# EAGLE design jlink_to_mini (EAGLE 9.6.2)
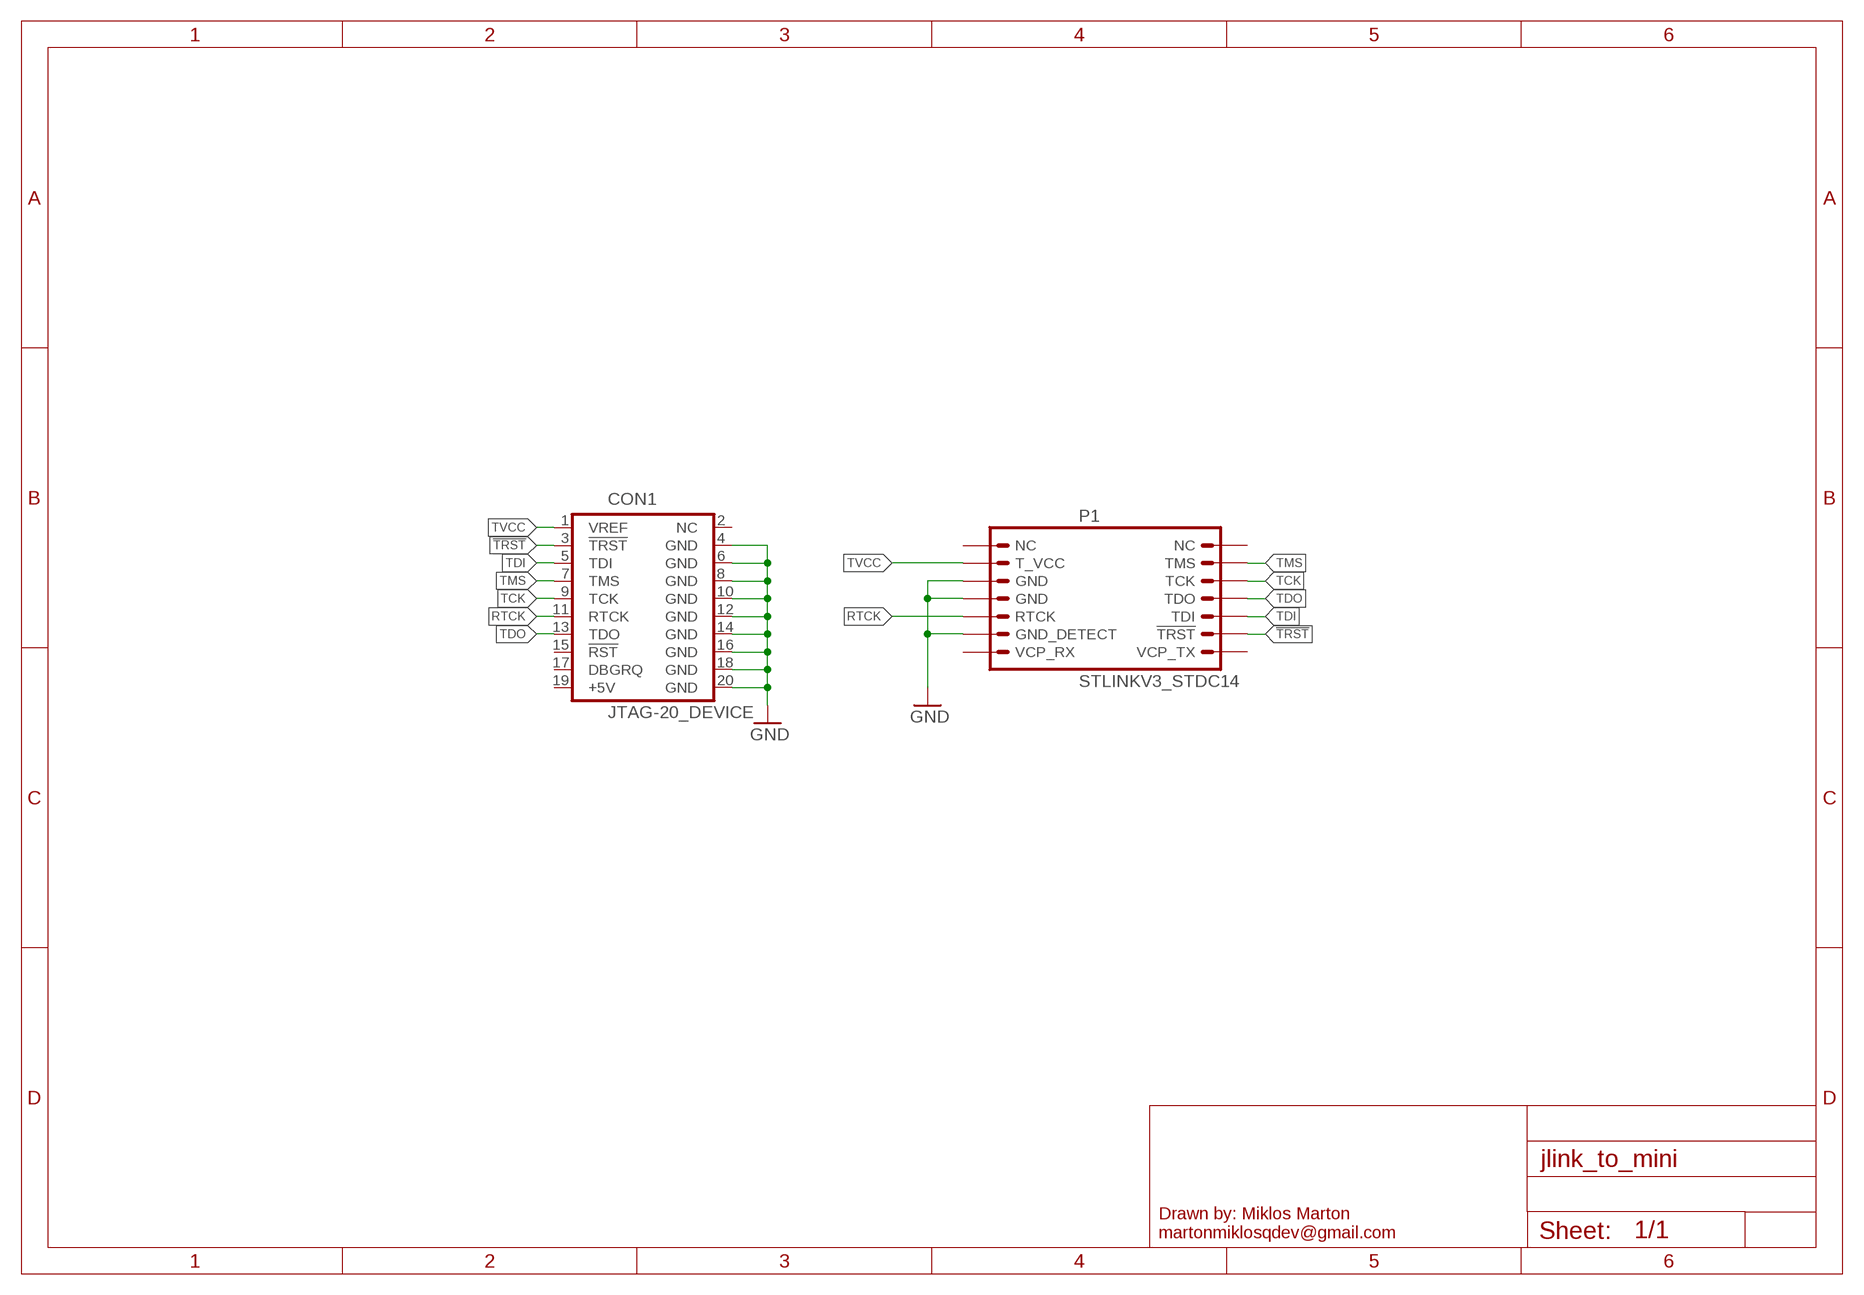
[diagram p0: schematic, sheet 1]

## Parts
CON1  JTAG-20_DEVICE  [2X10/90]
P1  STLINKV3_STDC14  [FTSH-107-01-L-DV-K]

## Nets
!TRST: CON1.3(!TRST) P1.12(!TRST)
GND: CON1.4(GND) CON1.6(GND) CON1.8(GND) CON1.10(GND) CON1.12(GND) CON1.14(GND) CON1.16(GND) CON1.18(GND) CON1.20(GND) P1.5(GND) P1.7(GND) P1.11(GND_DETECT)
RTCK: CON1.11(RTCK) P1.9(RTCK)
TCK: CON1.9(TCK) P1.6(TCK)
TDI: CON1.5(TDI) P1.10(TDI)
TDO: CON1.13(TDO) P1.8(TDO)
TMS: CON1.7(TMS) P1.4(TMS)
TVCC: CON1.1(VREF) P1.3(T_VCC)
Unconnected: CON1.2(NC) CON1.15(!RST) CON1.17(DBGRQ) CON1.19(+5V) P1.1(NC) P1.2(NC) P1.13(VCP_RX) P1.14(VCP_TX)

## Library data of the parts
CON1 = jtag:JTAG-20_DEVICE
P1 = jtag:STLINKV3_STDC14: FTSH Pin Header; OC_TME: ZL322-2X7P

## Board
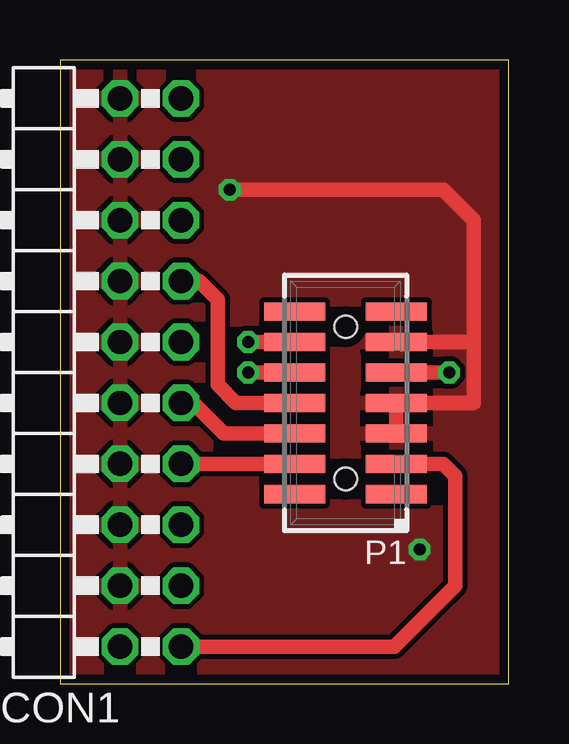
[diagram p1: board, top side]
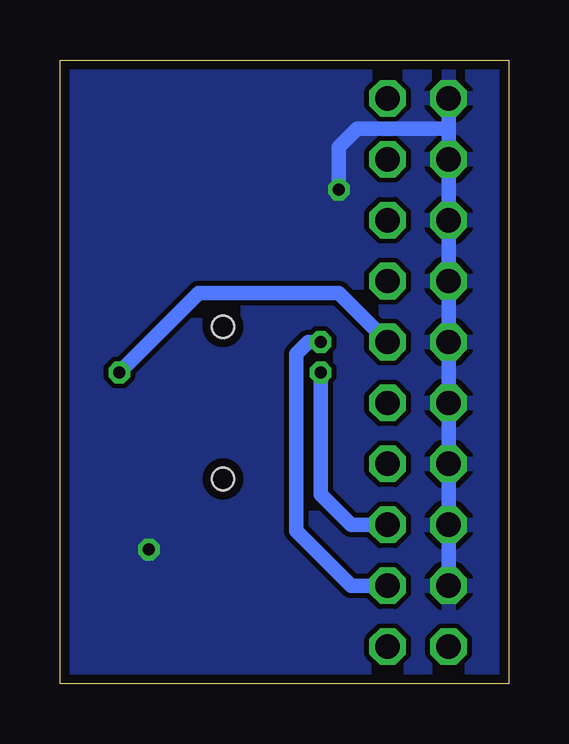
[diagram p2: board, bottom side, seen from below]

Size 18.69 x 26 mm. Coordinates in mm from the lower left corner, seen from the top.
Outline: 0,0 18.69,0 18.69,26 0,26 0,0
Copper layers (1*16): Top 0.035mm / dielectric 1.5mm / Bottom 0.035mm
Design rules "mikropan": minimum track width 8mil, minimum drill 0.5mm, track to track 8mil, track to pad 8mil, pad to pad 8mil, via to via 8mil, smd to smd 8mil, copper to edge 15mil, drill to drill 0.2mm, minimum pad ring 0.2mm, minimum via ring 0.2mm, stop-mask expansion 4mil, vias tented up to drill 0mil, thermal gap 10mil

### Footprints (pad centres in the part's own frame; a part is rotated, then mirrored left to right if it is on the bottom)
2X10/90 = drill 1.016 octagon: 1 -11.43,-6.35; 2 -11.43,-3.81; 3 -8.89,-6.35; 4 -8.89,-3.81; 5 -6.35,-6.35; 6 -6.35,-3.81; 7 -3.81,-6.35; 8 -3.81,-3.81; 9 -1.27,-6.35; 10 -1.27,-3.81; 11 1.27,-6.35; 12 1.27,-3.81; 13 3.81,-6.35; 14 3.81,-3.81; 15 6.35,-6.35; 16 6.35,-3.81; 17 8.89,-6.35; 18 8.89,-3.81; 19 11.43,-6.35; 20 11.43,-3.81
FTSH-107-01-L-DV-K = smd 0.762 x 2.54: 1 -3.81,-2.121; 2 -3.81,2.121; 3 -2.54,-2.121; 4 -2.54,2.121; 5 -1.27,-2.121; 6 -1.27,2.121; 7 0,-2.121; 8 0,2.121; 9 1.27,-2.121; 10 1.27,2.121; 11 2.54,-2.121; 12 2.54,2.121; 13 3.81,-2.121; 14 3.81,2.121 | hole 0.94: -3.175,0; 3.175,0

### Placement (x,y rotation side)
CON1  -1.31,12.97 90 top
P1  11.9,11.7 90 top

### Tracks (layer width: path | path; a pad name or v marks a point on that pad's centre or on a via)
!TRST  (via drill 0.5)
  Top 0.61: P1.12 v7.83,14.24
  Bottom 0.61: v7.83,14.24 8.34,14.24 8.85,13.73 8.85,12.97 8.85,6.37 6.56,4.08 CON1.3
GND  (via drill 0.5)
  Top 0.61: P1.5 P1.7 17.23,11.7 17.23,14.24 | 17.23,14.24 P1.11 | 17.23,14.24 17.23,19.32 15.96,20.59 v7.07,20.59
  Bottom 0.61: CON1.20 2.5,23.13 | 2.5,23.13 2.5,22.62 | 2.5,22.62 2.5,19.07 | 2.5,19.07 2.5,17.03 | 2.5,17.03 CON1.12 | CON1.12 CON1.4 | v7.07,20.59 7.07,22.37 6.31,23.13 2.5,23.13 | 2.5,22.62 CON1.18 2.5,19.07 | 2.5,17.03 CON1.16 CON1.12
  other vias: 14.99,5.59
  pour Bottom: 18.69,0 0,0 0,26 18.69,26
  pour Top: 18.69,0 0,0 0,26 18.69,26
RTCK  (via drill 0.5)
  Top 0.61: P1.9 v16.22,12.97
  Bottom 0.61: v16.22,12.97 12.91,16.27 7.07,16.27 CON1.11
TCK
  Top 0.61: P1.6 6.82,10.43 5.55,11.7 CON1.9
TDI  (via drill 0.5)
  Top 0.61: P1.10 v7.83,12.97
  Bottom 0.61: CON1.5 6.56,6.62 7.83,7.89 v7.83,12.97
TDO
  Top 0.61: P1.8 7.33,11.7 6.56,12.46 6.56,16.02 5.8,16.78 CON1.13
TMS
  Top 0.61: P1.4 CON1.7
TVCC
  Top 0.61: CON1.1 13.93,1.54 16.47,4.08 16.47,8.65 15.96,9.16 P1.3

### Text on the board
tPlate: M.M. 2019